# EAGLE design FM Radio Circuit (EAGLE 7.2.0)
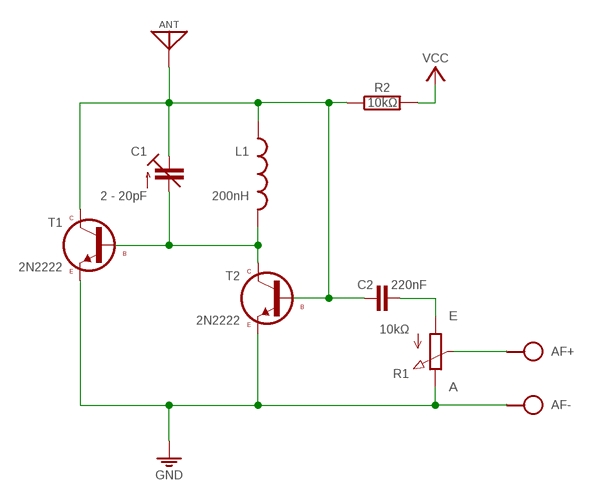
[diagram p0: schematic, sheet 1]

## Parts
AF  SPAD+-+-  [SPAD+-]
ANT  ANT  [SPAD]
BAT  VCC_GNDL  [SPAD-+]
C1  2 - 20pF  C-TR-PH201272222-808-2PINB  [TRIM-2222-808]
C2  220nF  C-H050-020X044  [C050-020X044]
L1  200nH  L04/7-V  [L-04/7-V]
R1  10kΩ  POT  [POT]
R2  10kΩ  R-H0204/10  [0204/10]
T1  2N2222  [TO92-EBC]
T2  2N2222  [TO92-EBC]

## Nets
GND: AF.1 BAT.1 R1.E T1.E T2.E
N$1: C1.2(A) L1.2 T1.B T2.C
N$3: C2.2 R1.A
N$4: ANT.1 C1.3(E) C2.1 L1.1 R2.1 T1.C T2.B
N$6: AF.2 R1.S
VCC: BAT.2 R2.2

## Library data of the parts
AF = pad:SPAD+-
ANT = pad:ANT
BAT = pad:VCC_GND
C1 = cap-trim:C-TR-PH20127
C2 = c:C-H
L1 = l:L: Potentiometers Beckman, Copal, Piher, Spectrol, Schukat Created by librarian@cadsoft.de
R1 = r:POT
R2 = r:R-H
T1 T2 = t:2N2222

## Board
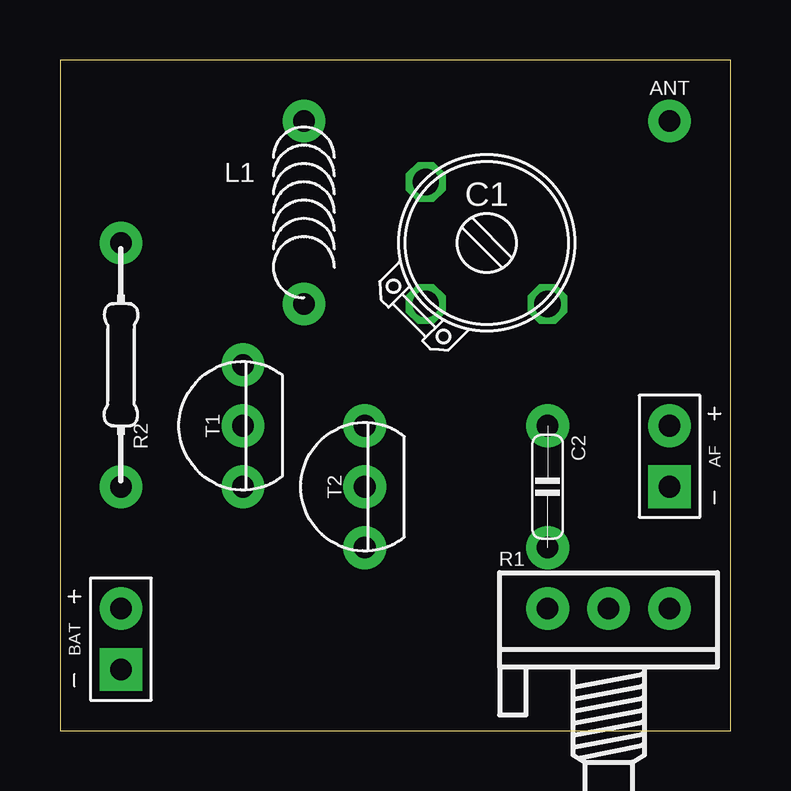
[diagram p1: board, top side]
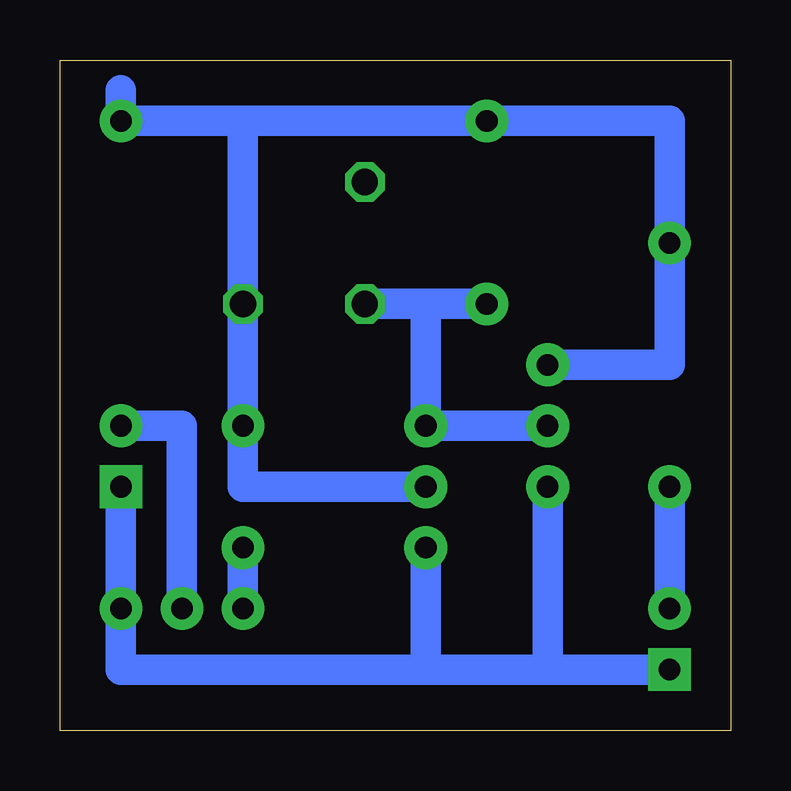
[diagram p2: board, bottom side, seen from below]

Size 27.94 x 27.94 mm. Coordinates in mm from the lower left corner, seen from the top.
Outline: 0,0 27.94,0 27.94,27.94 0,27.94 0,0
Copper layers (1*16): Top 0.035mm / dielectric 1.5mm / Bottom 0.035mm
Design rules "default": minimum track width 10mil, minimum drill 24mil, track to track 8mil, track to pad 8mil, pad to pad 8mil, via to via 8mil, smd to smd 8mil, copper to edge 40mil, drill to drill 8mil, minimum pad ring 10mil, minimum via ring 8mil, stop-mask expansion 4mil, vias tented up to drill 0mil, thermal gap 10mil

### Footprints (pad centres in the part's own frame; a part is rotated, then mirrored left to right if it is on the bottom)
SPAD+- = drill 0.9 pad 1.778 square: 1 0,-1.27 | drill 0.9 pad 1.778: 2 0,1.27
SPAD = drill 0.9 pad 1.778: 1 0,0
SPAD-+ = drill 0.9 pad 1.778 square: 1 0,-1.27 | drill 0.9 pad 1.778: 2 0,1.27
TRIM-2222-808 = drill 1.1 octagon: 1 -2.54,2.54; 2 -2.54,-2.54; 3 2.54,-2.54
C050-020X044 = drill 0.9 pad 1.778: 1 -2.54,0; 2 2.54,0
L-04/7-V = drill 0.9 pad 1.778: 1 0,3.81; 2 0,-3.81
POT = drill 0.9 pad 1.778: A -2.54,0; E 2.54,0; S 0,0
0204/10 = drill 0.9 pad 1.778: 1 -5.08,0; 2 5.08,0
TO92-EBC = drill 0.9 pad 1.778: B 0,0; C 0,-2.54; E 0,2.54

### Placement (x,y rotation side)
AF  25.4,11.43 0 top
ANT  25.4,25.4 270 top
BAT  2.54,3.81 0 top
C1  17.78,20.32 0 top
C2  20.32,10.16 270 top
L1  10.16,21.59 0 top
R1  22.86,5.08 0 top
R2  2.54,15.24 270 top
T1  7.62,12.7 180 top
T2  12.7,10.16 180 top

### Tracks (layer width: path | path; a pad name or v marks a point on that pad's centre or on a via)
GND
  Bottom 1.27: BAT.1 7.62,2.54 | 7.62,2.54 12.7,2.54 | 12.7,2.54 25.4,2.54 R1.E AF.1 | 7.62,7.62 T1.E 7.62,2.54 | T2.E 12.7,2.54
N$1
  Bottom 1.27: T1.B T2.C 12.7,17.78 L1.2 C1.2
N$3
  Bottom 1.27: R1.A C2.2
N$4
  Bottom 1.27: T1.C 2.54,15.24 R2.1 2.54,25.4 L1.1 20.32,25.4 | 20.32,25.4 ANT.1 25.4,26.67 | T2.B 20.32,10.16 C2.1 20.32,15.24 C1.3 20.32,25.4
N$6
  Bottom 1.27: AF.2 22.86,12.7 R1.S
VCC
  Bottom 1.27: BAT.2 R2.2